# Altium schematic sheet 09_AD.SchDoc
size A4; PageSetup: Record=PageOptions|CenterHorizontal=True|CenterVertical=True|PrintScale=0.97|XCorrection=1.00|YCorrection=1.00|PrintKind=0|BorderSize=5000000|LeftOffset=0|BottomOffset=0|Orientation=2|PaperLength=1000|PaperWidth=1000|Scale=100|PaperSource=7|PrintQuality=-4|MediaType=1|DitherType=10|PaperKind=A4|PrintScaleMode=1
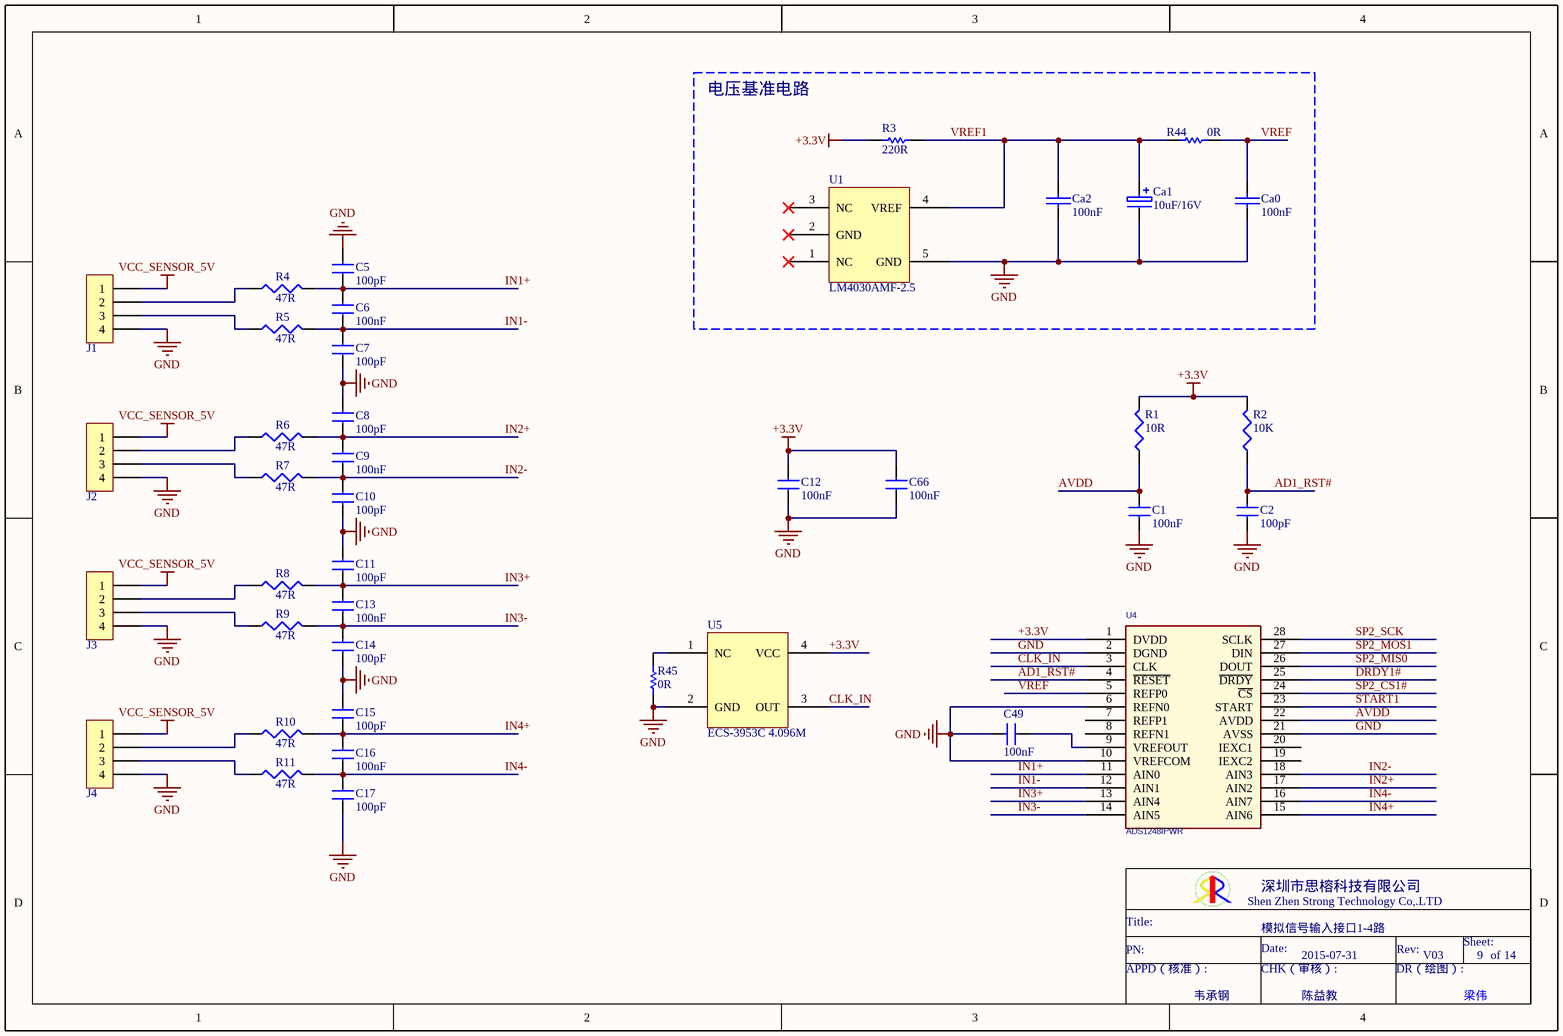
[diagram p0: 09_AD.SchDoc]

## Parts
C1  100nF  [0603C]
C2  100pF  [0603C]
C5  100pF  [0603C]
C6  100nF  [0603C]
C7  100pF  [0603C]
C8  100pF  [0603C]
C9  100nF  [0603C]
C10  100pF  [0603C]
C11  100pF  [0603C]
C12  100nF  [0603C]
C13  100nF  [0603C]
C14  100pF  [0603C]
C15  100pF  [0603C]
C16  100nF  [0603C]
C17  100pF  [0603C]
C49  100nF  [0603C]
C66  100nF  [0603C]
Ca0  100nF  [0603C]
Ca1  10uF/16V  [A]
Ca2  100nF  [0603C]
J1  XH-4A  [CN4-2.54]  (value not drawn)
J2  XH-4A  [CN4-2.54]  (value not drawn)
J3  XH-4A  [CN4-2.54]  (value not drawn)
J4  XH-4A  [CN4-2.54]  (value not drawn)
R1  10R  [0603R]
R2  10K  [0603R]
R3  220R  [0603R]
R4  47R  [0603R]
R5  47R  [0603R]
R6  47R  [0603R]
R7  47R  [0603R]
R8  47R  [0603R]
R9  47R  [0603R]
R10  47R  [0603R]
R11  47R  [0603R]
R44  0R  [0603R]
R45  0R  [0603R]
U1  LM4030AMF-2.5  [SOT23-5]
U4  ADS1248IPWR  [SOIC28]
U5  ECS-3953C 4.096M  [ECS-3953C]

## Blocks framed on the sheet
电压基准电路: Ca0-Ca2 R3 R44 U1

## Nets
+3.3V: C12.1 C66.2 R1.2 R2.2 R3.2 U4.1(DVDD) U5.4(VCC)
GND: C1.2 C2.2 C5.1 C7.2 C8.1 C10.2 C11.1 C12.2 C14.2 C15.1 C17.2 C49.2 C66.1 Ca0.2 Ca1.2 Ca2.2 J1.4 J2.4 J3.4 J4.4 R45.1 U1.5(GND) U4.2(DGND) U4.6(REFN0) U4.10(VREFCOM) U4.21(AVSS) U5.2(GND)
VCC_SENSOR_5V: J1.1 J2.1 J3.1 J4.1
AD1_RST#: C2.1 R2.1 U4.4(~{RESET})
AVDD: C1.1 R1.1 U4.22(AVDD)
CLK_IN: U4.3(CLK) U5.3(OUT)
DRDY1#: U4.25(~{DRDY})
IN1+: C5.2 C6.1 R4.2 U4.11(AIN0)
IN1-: C6.2 C7.1 R5.2 U4.12(AIN1)
IN2+: C8.2 C9.1 R6.2 U4.17(AIN2)
IN2-: C9.2 C10.1 R7.2 U4.18(AIN3)
IN3+: C11.2 C13.1 R8.2 U4.13(AIN4)
IN3-: C13.2 C14.1 R9.2 U4.14(AIN5)
IN4+: C15.2 C16.1 R10.2 U4.15(AIN6)
IN4-: C16.2 C17.1 R11.2 U4.16(AIN7)
SP2_CS1#: U4.24(~{CS})
SP2_MIS0: U4.26(DOUT)
SP2_MOS1: U4.27(DIN)
SP2_SCK: U4.28(SCLK)
START1: U4.23(START)
VREF: Ca0.1 R44.2 U4.5(REFP0)
VREF1: Ca1.1 Ca2.1 R3.1 R44.1 U1.4(VREF)
NetC49_1: C49.1 U4.9(VREFOUT)
NetJ1_2: J1.2 R4.1
NetJ1_3: J1.3 R5.1
NetJ2_2: J2.2 R6.1
NetJ2_3: J2.3 R7.1
NetJ3_2: J3.2 R8.1
NetJ3_3: J3.3 R9.1
NetJ4_2: J4.2 R10.1
NetJ4_3: J4.3 R11.1
NetR45_2: R45.2 U5.1(NC)

Not connected (* = marked no-connect by the designer): U1 1(NC)* 2(GND)* 3(NC)*; U4 7(REFP1) 8(REFN1) 19(IEXC2) 20(IEXC1)

## Notes on the sheet
- 模拟信号输入接口1-4路
- 2015-07-31
- V03
- 9
- 14
- 韦承钢
- 陈益教
- Shen Zhen Strong Technology Co,.LTD
- 深圳市思榕科技有限公司
- Title:
- PN:
- APPD（核准）:
- Date:
- CHK（审核）:
- DR（绘图）:
- Rev:
- Sheet:
- of
- 梁伟

## Library data of the parts
C1 C6 C9 C12 C13 C16 C49 C66 = 电容: Capacitor
  C1 C6 C9 C12 C13 C16 C49: Value: 100nF
  C66: C318: 100NF
C2 C5 C7 C8 C10 C11 C14 C15 C17 = 电容: Capacitor; Value: 100nF
Ca0 Ca2 = CAP
Ca1 = CAP2
J1-J4 = CON4
R1 R2 R4-R11 = RES1
R3 R44 R45 = RES
U1 = LM4030: Voltage adj; Published: 8-Jun-2000; LatestRevisionDate: 29-May-2009; LatestRevisionNote: IPC-7351 Footprint Added.; PackageVersion: Aug-1999; PackageReference: SOT-23B; Publisher: Altium Limited; PackageDescription: 3-Pin SOT-23 Package 0.95 mm Pitch, 2.4 mm Lead Span
U4 = ADS1248IPWR: 24ADC; Part Class: ICS - LOGIC; Mfr Code: TI; Manufacturer: Texas Instruments; Manufacturer Part Num: SN74CBTD3384CDBRE4; DESCRIPTION: IC - 10 BIT FET BUS SWITCH; Item Num: P01-13010R; Num Pins: 24; RoHS Compliant: 1
U5 = ECS-3953C: 贴片晶振; Published: 8-Jun-2000; LatestRevisionDate: 29-May-2009; LatestRevisionNote: IPC-7351 Footprint Added.; PackageVersion: Aug-1999; PackageReference: SOT-23B; Publisher: Altium Limited; PackageDescription: 3-Pin SOT-23 Package 0.95 mm Pitch, 2.4 mm Lead Span